# Altium schematic sheet Sheet1_Fontes_Chaveadas_Potencia.SchDoc: Buck 24V 100W - Potência
size A4; ApprovedBy: Prof. Me. Halisson Alves de Oliveira; CheckedBy: Manuel Batista Neto; Author: Artur Alves Torres de Araujo; DrawnBy: Artur Alves Torres de Araujo; Engineer: Artur Alves Torres de Araujo; Organization: UNIFOR - Universidade de Fortaleza; Address1: Av. Washington Soares, 1321; Address2: Edson Queiroz; Address3: CEP: 60811-905; Address4: Fortaleza - CE; DocumentNumber: 2; Revision: v1.0; SheetNumber: 2; SheetTotal: 4; Graduando:: Artur Alves Torres de Araujo; matAutor: 1610674; matRevisor: 1710872; DocumentName: Sheet1_Fontes_Chaveadas_Potencia.SchDoc
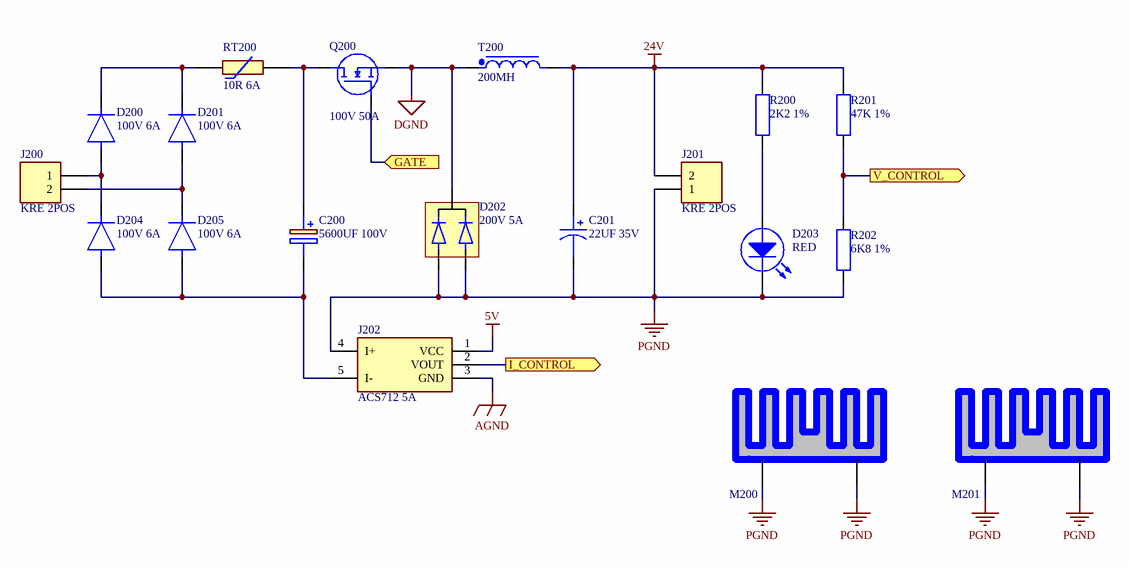
[diagram p0: Sheet1_Fontes_Chaveadas_Potencia.SchDoc]

## Parts
C200  5600UF 100V  [CAP_RAD_D35MM_L10MM]
C201  22UF 35V  [CAP_RAD_D6MM3_L2MM5]
D200  100V 6A  [DIO_P600_AXIAL]
D201  100V 6A  [DIO_P600_AXIAL]
D202  200V 5A  [PTH_TO220AB]
D203  RED  [DIO_PTH_LED_RED]
D204  100V 6A  [DIO_P600_AXIAL]
D205  100V 6A  [DIO_P600_AXIAL]
J200  KRE 2POS  [CONN_KF3012P]
J201  KRE 2POS  [CONN_KF3012P]
J202  ACS712 5A  [MODULE_ACS712]
M200  HEATSINK  [HEATSINK_16X23MM]  (value not drawn)
M201  HEATSINK  [HEATSINK_11X21MM]  (value not drawn)
Q200  100V 50A  [PTH_TO220AB]
R200  2K2 1%  [RES_PTH_AXIAL_250MW]
R201  47K 1%  [RES_PTH_AXIAL_250MW]
R202  6K8 1%  [RES_PTH_AXIAL_250MW]
RT200  10R 6A  [NTC_P7MM8_13MM]
T200  200MH  [TRF_1COIL]

## Ports
GATE (in), I_CONTROL (out), V_CONTROL (out)

## Nets
5V: J202.1(VCC)
24V: C201.1(+) J201.2 R200.1 R201.1 T200.2(Pri-)
AGND: J202.3(GND)
DGND: D202.2(K) Q200.3(S) T200.1(Pri+)
PGND: C201.2(-) D202.1(A1) D202.3(A2) D203.2(K) J201.1 J202.4(I+) M200.1 M200.2 M201.1 M201.2 R202.2
GATE: Q200.1(G) ; port GATE
I_CONTROL: J202.2(VOUT) ; port I_CONTROL
V_CONTROL: R201.2 R202.1 ; port V_CONTROL
NetC200_1: C200.1(+) Q200.2(D) RT200.2
NetC200_2: C200.2(-) D204.2(A) D205.2(A) J202.5(I-)
NetD200_1: D200.1(K) D201.1(K) RT200.1
NetD200_2: D200.2(A) D204.1(K) J200.1
NetD201_2: D201.2(A) D205.1(K) J200.2
NetD203_1: D203.1(A) R200.2

## Notes on the sheet
- Título:
- Tamanho:
- Revisor:
- Autor:
- A4
- Data:
- Versão:
- Mat:
- Curso:
- Bacharelado em Engenharia Eletrônica
- Aprovado por:
- Disciplina:
- Projeto de Fontes Chaveadas
- Folha:
- de

## Library data of the parts
C200 = CAP_ALUM_5600UF_100V_RAD: CAP ALUM 5600UF 20% 100V SNAP; PartNumber: MAL225659562E3; DkPart: MAL225659562E3-ND; Manufacturer: Vishay BCcomponents; DkMOQ: 1; DkPrice: 15,76; BrPrice: 0; Datasheet: https://www.vishay.com/docs/28410/256pmg-si.pdf
C201 = CAP_ALUM_22UF_35V_RAD: CAP ALUM POLY 22UF 20% 35V T/H; PartNumber: 870055673002; DkPart: 732-6368-1-ND; Manufacturer: Wurth-Elektronik; DkMOQ: 1; DkPrice: 0,93; BrPrice: 0; BrLink: https://www.autocorerobotica.com.br/capacitor-eletrolitico-22uf-50v; Datasheet: https://www.we-online.com/katalog/datasheet/870055673002.pdf
D200 D201 D204 D205 = DIO_PTH_STD_100V_6A_P600B: DIODE GEN PURP 100V 6A P600; PartNumber: P600B-E3/54; DkPart: P600B-E3/54GICT-ND; Manufacturer: Vishay General Semiconductor; DkMOQ: 1; DkPrice: 0,94; BrPrice: 0; Datasheet: https://www.vishay.com/docs/88692/p600a.pdf
D202 = DIO_PTH_SCHOTTKY_MBR10200CT: DIODE SCHOTTKY 200V 5A TO220AB; DkPart: F7347-ND; Manufacturer: Littelfuse Inc.; DkMOQ: 1; DkPrice: 2,04; BrPrice: 0; PartNumber: MBR10200CT; Datasheet: https://www.littelfuse.com/~/media/electronics/datasheets/power_semiconductors/littelfuse_power_semiconductor_schottky_diode_mbr10200ct_datasheet.pdf.pdf
D203 = DIO_PTH_LED_RED_5MM: LED RED DIFFUSED T-1 3/4 T/H; PartNumber: XLUR12D; DkPart: 1497-1031-ND; Manufacturer: SunLED; DkMOQ: 1; DkPrice: 0,29; BrPrice: 0; Datasheet: https://www.sunledusa.com/products/spec/XLUR12D.pdf
J200 J201 = CONN_2POS: TERM BLK 2POS SIDE ENTRY 5MM PCB; PartNumber: 1776244-2; DkPart: A97996-ND; Manufacturer: TE Connectivity AMP Connectors; DkMOQ: 1; DkPrice: 1,1; BrPrice: 0; Datasheet: https://www.te.com/commerce/DocumentDelivery/DDEController?Action=srchrtrv&DocNm=1308389_EUROSTYLE_TERMINAL_BLOCKS&DocType=CS&DocLang=English
J202 = MODULE_SENSOR_ACS712: MODULE CURRENT SENSOR ACS712 5A; PartNumber: _MODULE_ACS712; Manufacturer: PUBLIC DOMAIN; DkPrice: 0; BrMOQ: 1; BrPrice: 27,9; BrLink: https://www.autocorerobotica.com.br/modulo-sensor-de-corrente-acs712-5a; Datasheet: N/A; DkMOQ: N/A; DkPart: N/A
M200 M201 = HEATSINK: HEATSINK 16X23MM
Q200 = MOSFET_SUP70090E: MOSFET N-CH 100V 50A TO220AB; PartNumber: SUP70090E-GE3; DkPart: SUP70090E-GE3-ND; Manufacturer: Vishay Siliconix; DkMOQ: 1; DkPrice: 3,21; BrPrice: 0; Datasheet: https://www.vishay.com/docs/65436/sup70090e.pdf
R200 = RES_2K2_1%_250MW_AXIAL: RES 2.2K OHM 1% 1/4W AXIAL; PartNumber: MFR-25FBF52-2K2; DkPart: MFR-25FBF52-2K2-ND; Manufacturer: YAGEO; DkMOQ: 1; DkPrice: 0,10; BrPrice: 0; Datasheet: https://www.yageo.com/upload/media/product/productsearch/datasheet/lr/YAGEO%20MFR_datasheet_2021v1.pdf
R201 = RES_47K_1%_250MW_AXIAL: RES 47K OHM 1% 1/4W AXIAL; PartNumber: MFR-25FTE52-47K; DkPart: 13-MFR-25FTE52-47KCT-ND; Manufacturer: YAGEO; DkMOQ: 1; DkPrice: 0,1; BrPrice: 0; Datasheet: https://www.yageo.com/upload/media/product/productsearch/datasheet/lr/YAGEO%20MFR_datasheet_2021v1.pdf
R202 = RES_6K8_1%_250MW_AXIAL: RES 6.8K OHM 1% 1/4W AXIAL; PartNumber: MFR-25FTE52-6K8; DkPart: 13-MFR-25FTE52-6K8CT-ND; Manufacturer: YAGEO; DkMOQ: 1; DkPrice: 0,1; BrPrice: 0; Datasheet: https://www.yageo.com/upload/media/product/productsearch/datasheet/lr/YAGEO%20MFR_datasheet_2021v1.pdf
RT200 = NTC_10R_6A: ICL 10 OHM 20% 6A 13MM; DkPart: 570-1078-ND; Manufacturer: Ametherm; PartNumber: SL12 10006; DkMOQ: 1; DkPrice: 0,81; BrPrice: 0; Datasheet: https://www.ametherm.com/datasheetspdf/SL1210006.pdf
T200 = INDUTOR_BUCK: INDUCTOR 200MH; PartNumber: _TRAFO_01; Manufacturer: UNIFOR; DkPrice: 0; Datasheet: N/A; DkMOQ: N/A; DkPart: N/A; BrPrice: 0